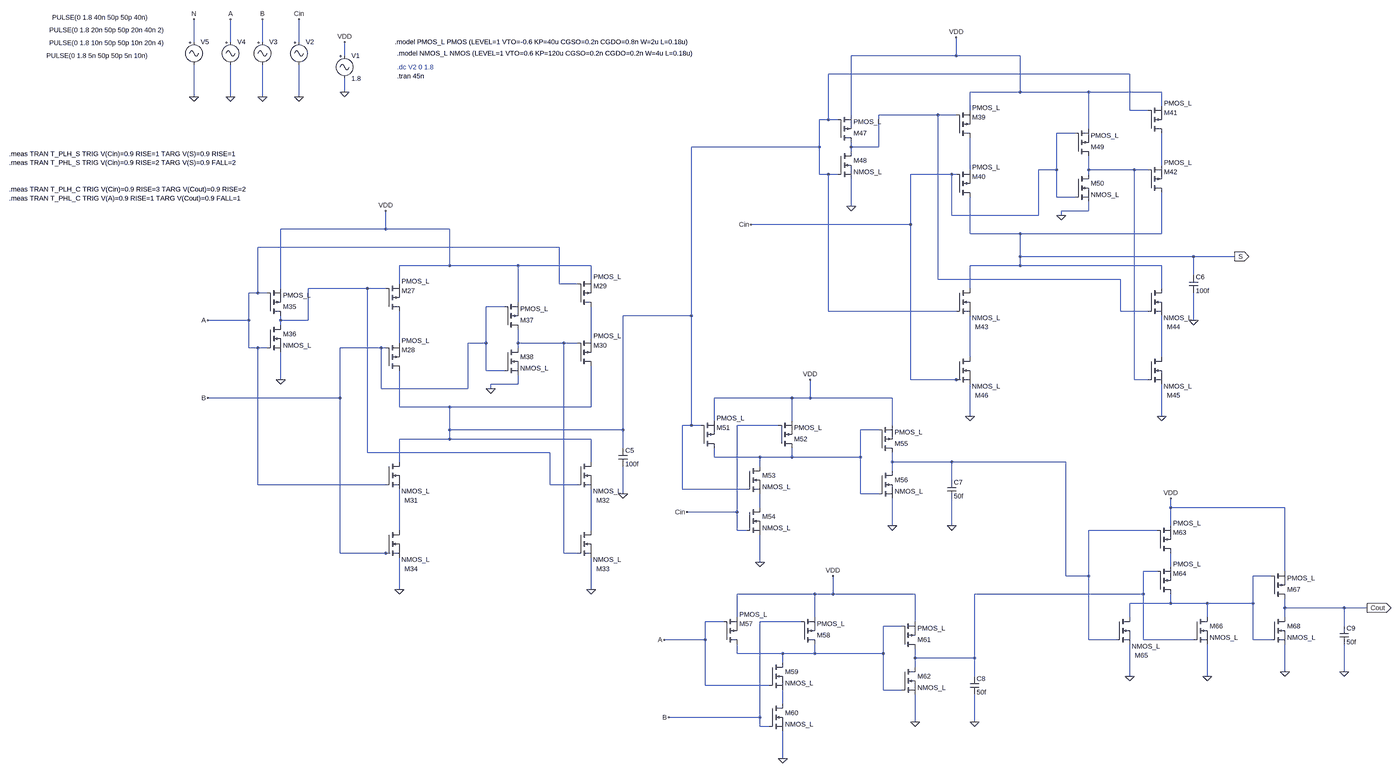
[diagram p0: schematic FullAdder.asc, whole sheet]
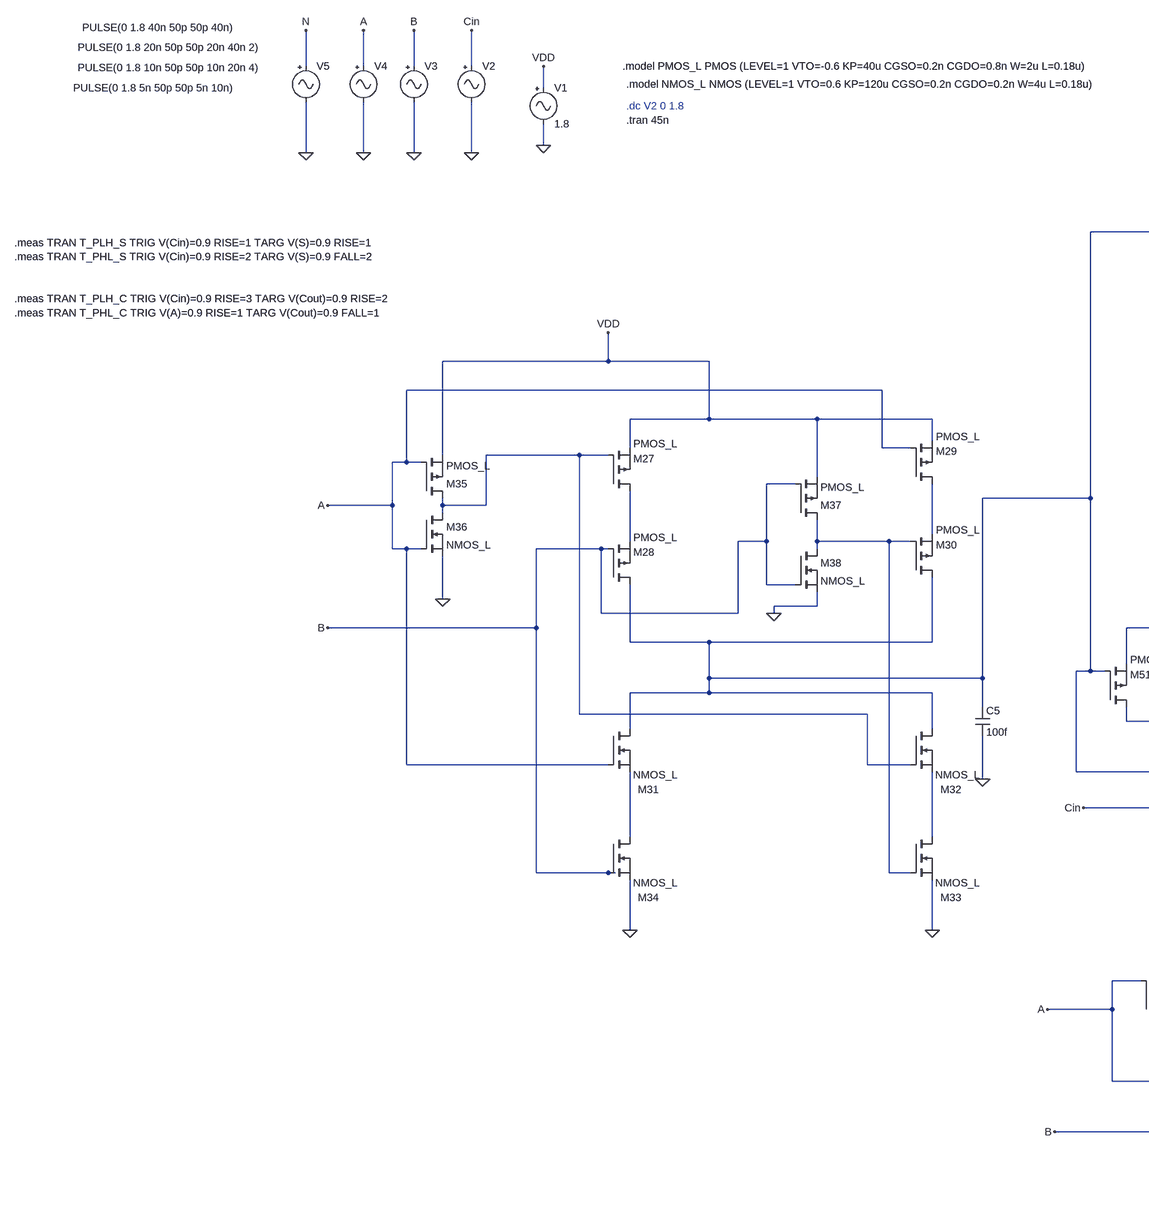
[diagram p1: schematic FullAdder.asc, part, row 1 of 1, column 1 of 2]
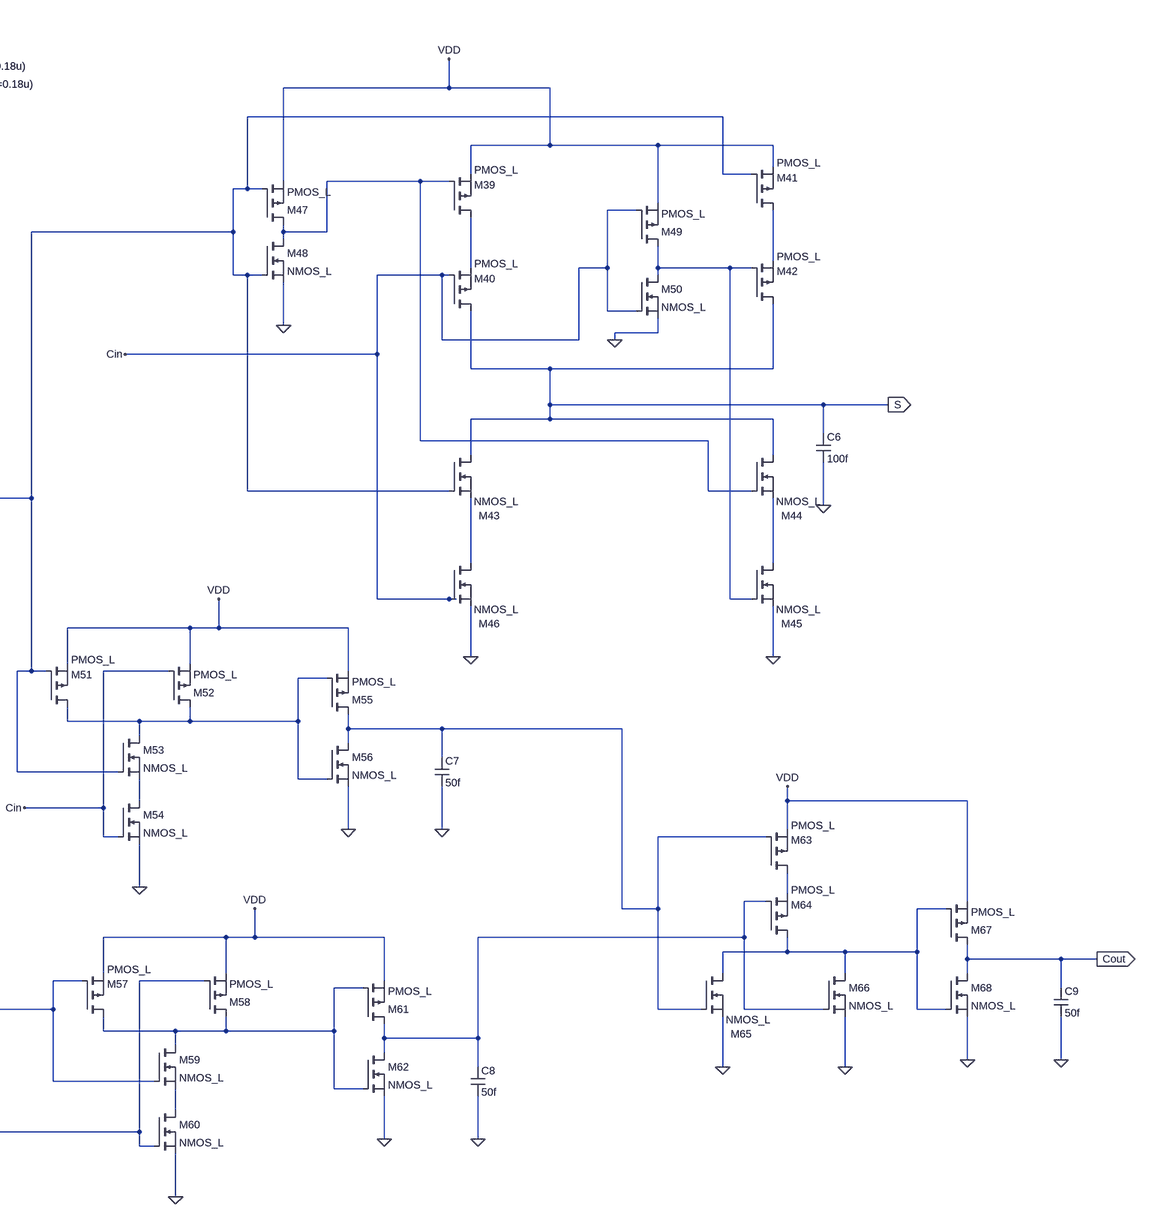
[diagram p2: schematic FullAdder.asc, part, row 1 of 1, column 2 of 2]
FullAdder.asc, the LTspice schematic file:
Version 4.1
SHEET 1 1064 4084
WIRE -4256 1552 -4256 1472
WIRE -4128 1552 -4128 1472
WIRE -4016 1552 -4016 1472
WIRE -3888 1552 -3888 1472
WIRE -3728 1600 -3728 1552
WIRE -1584 1600 -1584 1536
WIRE -1584 1600 -1952 1600
WIRE -1360 1600 -1584 1600
WIRE -976 1664 -2032 1664
WIRE -3728 1728 -3728 1680
WIRE -1360 1728 -1360 1600
WIRE -1360 1728 -1536 1728
WIRE -1120 1728 -1360 1728
WIRE -864 1728 -1120 1728
WIRE -4256 1744 -4256 1632
WIRE -4128 1744 -4128 1632
WIRE -4016 1744 -4016 1632
WIRE -3888 1744 -3888 1632
WIRE -864 1776 -864 1728
WIRE -1536 1792 -1536 1728
WIRE -976 1792 -976 1664
WIRE -912 1792 -976 1792
WIRE -1952 1808 -1952 1600
WIRE -1648 1808 -1856 1808
WIRE -1584 1808 -1648 1808
WIRE -2032 1824 -2032 1664
WIRE -2032 1824 -2064 1824
WIRE -2000 1824 -2032 1824
WIRE -1120 1856 -1120 1728
WIRE -1168 1872 -1232 1872
WIRE -2064 1920 -2064 1824
WIRE -2064 1920 -2512 1920
WIRE -1952 1920 -1952 1904
WIRE -1856 1920 -1856 1808
WIRE -1856 1920 -1952 1920
WIRE -1952 1936 -1952 1920
WIRE -864 1984 -864 1872
WIRE -1536 2000 -1536 1888
WIRE -1232 2000 -1232 1872
WIRE -1232 2000 -1296 2000
WIRE -1120 2000 -1120 1952
WIRE -960 2000 -1120 2000
WIRE -912 2000 -960 2000
WIRE -2064 2016 -2064 1920
WIRE -2032 2016 -2064 2016
WIRE -2000 2016 -2032 2016
WIRE -1600 2016 -1744 2016
WIRE -1584 2016 -1600 2016
WIRE -1120 2016 -1120 2000
WIRE -1232 2096 -1232 2000
WIRE -1168 2096 -1232 2096
WIRE -1952 2128 -1952 2032
WIRE -1120 2144 -1120 2112
WIRE -1120 2144 -1216 2144
WIRE -1600 2160 -1600 2016
WIRE -1296 2160 -1296 2000
WIRE -1296 2160 -1600 2160
WIRE -1216 2160 -1216 2144
WIRE -1744 2192 -1744 2016
WIRE -1744 2192 -2304 2192
WIRE -3584 2208 -3584 2144
WIRE -3584 2208 -3952 2208
WIRE -3360 2208 -3584 2208
WIRE -1536 2224 -1536 2096
WIRE -1360 2224 -1536 2224
WIRE -864 2224 -864 2080
WIRE -864 2224 -1360 2224
WIRE -2976 2272 -4032 2272
WIRE -1360 2304 -1360 2224
WIRE -752 2304 -1360 2304
WIRE -608 2304 -752 2304
WIRE -3360 2336 -3360 2208
WIRE -3360 2336 -3536 2336
WIRE -3120 2336 -3360 2336
WIRE -2864 2336 -3120 2336
WIRE -1360 2336 -1360 2304
WIRE -1360 2336 -1536 2336
WIRE -864 2336 -1360 2336
WIRE -752 2368 -752 2304
WIRE -2864 2384 -2864 2336
WIRE -1648 2384 -1648 1808
WIRE -1008 2384 -1648 2384
WIRE -3536 2400 -3536 2336
WIRE -2976 2400 -2976 2272
WIRE -2912 2400 -2976 2400
WIRE -3952 2416 -3952 2208
WIRE -3648 2416 -3856 2416
WIRE -3584 2416 -3648 2416
WIRE -1536 2416 -1536 2336
WIRE -864 2416 -864 2336
WIRE -4032 2432 -4032 2272
WIRE -4032 2432 -4064 2432
WIRE -4000 2432 -4032 2432
WIRE -3120 2464 -3120 2336
WIRE -3168 2480 -3232 2480
WIRE -2032 2496 -2032 2016
WIRE -1584 2496 -2032 2496
WIRE -1008 2496 -1008 2384
WIRE -912 2496 -1008 2496
WIRE -2512 2512 -2512 1920
WIRE -2512 2512 -2752 2512
WIRE -4064 2528 -4064 2432
WIRE -4064 2528 -4208 2528
WIRE -3952 2528 -3952 2512
WIRE -3856 2528 -3856 2416
WIRE -3856 2528 -3952 2528
WIRE -752 2528 -752 2432
WIRE -3952 2544 -3952 2528
WIRE -2864 2592 -2864 2480
WIRE -3536 2608 -3536 2496
WIRE -3232 2608 -3232 2480
WIRE -3232 2608 -3296 2608
WIRE -3120 2608 -3120 2560
WIRE -2960 2608 -3120 2608
WIRE -2912 2608 -2960 2608
WIRE -4064 2624 -4064 2528
WIRE -4032 2624 -4064 2624
WIRE -4000 2624 -4032 2624
WIRE -3600 2624 -3744 2624
WIRE -3584 2624 -3600 2624
WIRE -3120 2624 -3120 2608
WIRE -1536 2656 -1536 2512
WIRE -864 2656 -864 2512
WIRE -3232 2704 -3232 2608
WIRE -3168 2704 -3232 2704
WIRE -3952 2736 -3952 2640
WIRE -1744 2736 -1744 2192
WIRE -1584 2736 -1744 2736
WIRE -1568 2736 -1584 2736
WIRE -960 2736 -960 2000
WIRE -912 2736 -960 2736
WIRE -3120 2752 -3120 2720
WIRE -3120 2752 -3216 2752
WIRE -3600 2768 -3600 2624
WIRE -3296 2768 -3296 2608
WIRE -3296 2768 -3600 2768
WIRE -3216 2768 -3216 2752
WIRE -3744 2800 -3744 2624
WIRE -3744 2800 -4208 2800
WIRE -2160 2800 -2432 2800
WIRE -2096 2800 -2096 2736
WIRE -2096 2800 -2160 2800
WIRE -1808 2800 -2096 2800
WIRE -3536 2832 -3536 2704
WIRE -3360 2832 -3536 2832
WIRE -2864 2832 -2864 2688
WIRE -2864 2832 -3360 2832
WIRE -1536 2864 -1536 2752
WIRE -864 2864 -864 2752
WIRE -2432 2880 -2432 2800
WIRE -2160 2880 -2160 2800
WIRE -2512 2896 -2512 2512
WIRE -2512 2896 -2544 2896
WIRE -2480 2896 -2512 2896
WIRE -2208 2896 -2352 2896
WIRE -1808 2896 -1808 2800
WIRE -3360 2912 -3360 2832
WIRE -2752 2912 -2752 2512
WIRE -2752 2912 -3360 2912
WIRE -1856 2912 -1920 2912
WIRE -3360 2944 -3360 2912
WIRE -3360 2944 -3536 2944
WIRE -2864 2944 -3360 2944
WIRE -2752 2976 -2752 2912
WIRE -3648 2992 -3648 2416
WIRE -3008 2992 -3648 2992
WIRE -2432 3008 -2432 2976
WIRE -2272 3008 -2432 3008
WIRE -2160 3008 -2160 2976
WIRE -2160 3008 -2272 3008
WIRE -1920 3008 -1920 2912
WIRE -1920 3008 -2160 3008
WIRE -3536 3024 -3536 2944
WIRE -2864 3024 -2864 2944
WIRE -1808 3024 -1808 2992
WIRE -1600 3024 -1808 3024
WIRE -1200 3024 -1600 3024
WIRE -2272 3040 -2272 3008
WIRE -1808 3056 -1808 3024
WIRE -1600 3088 -1600 3024
WIRE -4032 3104 -4032 2624
WIRE -3584 3104 -4032 3104
WIRE -3008 3104 -3008 2992
WIRE -2912 3104 -3008 3104
WIRE -2544 3120 -2544 2896
WIRE -2320 3120 -2544 3120
WIRE -2752 3136 -2752 3040
WIRE -1920 3136 -1920 3008
WIRE -1856 3136 -1920 3136
WIRE -2272 3184 -2272 3136
WIRE -832 3184 -832 3152
WIRE -432 3184 -832 3184
WIRE -2352 3200 -2352 2896
WIRE -2352 3200 -2528 3200
WIRE -1808 3248 -1808 3152
WIRE -1600 3248 -1600 3152
WIRE -832 3248 -832 3184
WIRE -3536 3264 -3536 3120
WIRE -2864 3264 -2864 3120
WIRE -2352 3264 -2352 3200
WIRE -2320 3264 -2352 3264
WIRE -880 3264 -1120 3264
WIRE -3744 3344 -3744 2800
WIRE -3584 3344 -3744 3344
WIRE -3568 3344 -3584 3344
WIRE -2960 3344 -2960 2608
WIRE -2912 3344 -2960 3344
WIRE -2272 3376 -2272 3280
WIRE -832 3392 -832 3344
WIRE -880 3408 -928 3408
WIRE -432 3408 -432 3184
WIRE -1200 3424 -1200 3024
WIRE -1120 3424 -1120 3264
WIRE -1120 3424 -1200 3424
WIRE -480 3424 -544 3424
WIRE -3536 3472 -3536 3360
WIRE -2864 3472 -2864 3360
WIRE -2080 3488 -2352 3488
WIRE -2016 3488 -2016 3424
WIRE -2016 3488 -2080 3488
WIRE -1728 3488 -2016 3488
WIRE -928 3488 -928 3408
WIRE -928 3488 -1520 3488
WIRE -832 3520 -832 3488
WIRE -832 3520 -976 3520
WIRE -704 3520 -832 3520
WIRE -544 3520 -544 3424
WIRE -544 3520 -704 3520
WIRE -432 3536 -432 3504
WIRE -224 3536 -432 3536
WIRE -144 3536 -224 3536
WIRE -2352 3568 -2352 3488
WIRE -2080 3568 -2080 3488
WIRE -976 3568 -976 3520
WIRE -704 3568 -704 3520
WIRE -432 3568 -432 3536
WIRE -2400 3584 -2464 3584
WIRE -2128 3584 -2272 3584
WIRE -1728 3584 -1728 3488
WIRE -1776 3600 -1840 3600
WIRE -224 3600 -224 3536
WIRE -2464 3648 -2464 3584
WIRE -2464 3648 -2608 3648
WIRE -1120 3648 -1120 3424
WIRE -1024 3648 -1120 3648
WIRE -928 3648 -928 3488
WIRE -752 3648 -928 3648
WIRE -544 3648 -544 3520
WIRE -480 3648 -544 3648
WIRE -2352 3696 -2352 3664
WIRE -2192 3696 -2352 3696
WIRE -2080 3696 -2080 3664
WIRE -2080 3696 -2192 3696
WIRE -1840 3696 -1840 3600
WIRE -1840 3696 -2080 3696
WIRE -1728 3712 -1728 3680
WIRE -1520 3712 -1520 3488
WIRE -1520 3712 -1728 3712
WIRE -2192 3728 -2192 3696
WIRE -1728 3744 -1728 3712
WIRE -432 3760 -432 3664
WIRE -224 3760 -224 3664
WIRE -1520 3776 -1520 3712
WIRE -976 3776 -976 3664
WIRE -704 3776 -704 3664
WIRE -2464 3808 -2464 3648
WIRE -2240 3808 -2464 3808
WIRE -1840 3824 -1840 3696
WIRE -1776 3824 -1840 3824
WIRE -2192 3872 -2192 3824
WIRE -2272 3920 -2272 3584
WIRE -2272 3920 -2592 3920
WIRE -1728 3936 -1728 3840
WIRE -1520 3936 -1520 3840
WIRE -2272 3952 -2272 3920
WIRE -2240 3952 -2272 3952
WIRE -2192 4064 -2192 3968
FLAG -3728 1552 VDD
FLAG -3728 1728 0
FLAG -3888 1744 0
FLAG -3888 1472 Cin
FLAG -4016 1744 0
FLAG -4016 1472 B
FLAG -4128 1744 0
FLAG -4128 1472 A
FLAG -4256 1744 0
FLAG -4256 1472 N
FLAG -3584 2144 VDD
FLAG -2864 3472 0
FLAG -3536 3472 0
FLAG -2752 3136 0
FLAG -3216 2768 0
FLAG -4208 2528 A
FLAG -4208 2800 B
FLAG -3952 2736 0
FLAG -1584 1536 VDD
FLAG -864 2864 0
FLAG -1536 2864 0
FLAG -608 2304 S
IOPIN -608 2304 Out
FLAG -752 2528 0
FLAG -1216 2160 0
FLAG -1952 2128 0
FLAG -1808 3248 0
FLAG -1600 3248 0
FLAG -2096 2736 VDD
FLAG -2272 3376 0
FLAG -1728 3936 0
FLAG -1520 3936 0
FLAG -2016 3424 VDD
FLAG -2192 4064 0
FLAG -2304 2192 Cin
FLAG -2528 3200 Cin
FLAG -2608 3648 A
FLAG -2592 3920 B
FLAG -832 3152 VDD
FLAG -976 3776 0
FLAG -704 3776 0
FLAG -432 3760 0
FLAG -144 3536 Cout
IOPIN -144 3536 Out
FLAG -224 3760 0
SYMBOL Misc\\signal -3728 1584 R0
WINDOW 123 0 0 Left 0
WINDOW 39 0 0 Left 0
SYMATTR InstName V1
SYMATTR Value 1.8
SYMBOL Misc\\signal -3888 1536 R0
WINDOW 3 -885 64 Left 2
WINDOW 123 0 0 Left 0
WINDOW 39 0 0 Left 0
SYMATTR Value PULSE(0 1.8 5n 50p 50p 5n 10n)
SYMATTR InstName V2
SYMBOL Misc\\signal -4016 1536 R0
WINDOW 3 -747 19 Left 2
WINDOW 123 0 0 Left 0
WINDOW 39 0 0 Left 0
SYMATTR Value PULSE(0 1.8 10n 50p 50p 10n 20n 4)
SYMATTR InstName V3
SYMBOL Misc\\signal -4128 1536 R0
WINDOW 3 -635 -26 Left 2
WINDOW 123 0 0 Left 0
WINDOW 39 0 0 Left 0
SYMATTR Value PULSE(0 1.8 20n 50p 50p 20n 40n 2)
SYMATTR InstName V4
SYMBOL Misc\\signal -4256 1536 R0
WINDOW 3 -497 -70 Left 2
WINDOW 123 0 0 Left 0
WINDOW 39 0 0 Left 0
SYMATTR Value PULSE(0 1.8 40n 50p 50p 40n)
SYMATTR InstName V5
SYMBOL pmos -3584 2496 M180
WINDOW 0 56 72 Left 2
WINDOW 3 56 105 Left 2
SYMATTR InstName M27
SYMATTR Value PMOS_L
SYMBOL pmos -3584 2704 M180
WINDOW 0 56 72 Left 2
WINDOW 3 56 105 Left 2
SYMATTR InstName M28
SYMATTR Value PMOS_L
SYMBOL pmos -2912 2480 M180
WINDOW 0 56 72 Left 2
WINDOW 3 56 105 Left 2
SYMATTR InstName M29
SYMATTR Value PMOS_L
SYMBOL pmos -2912 2688 M180
WINDOW 0 56 72 Left 2
WINDOW 3 56 105 Left 2
SYMATTR InstName M30
SYMATTR Value PMOS_L
SYMBOL nmos -3584 3024 R0
WINDOW 0 66 135 Left 2
WINDOW 3 55 103 Left 2
SYMATTR InstName M31
SYMATTR Value NMOS_L
SYMBOL nmos -2912 3024 R0
WINDOW 0 66 135 Left 2
WINDOW 3 55 103 Left 2
SYMATTR InstName M32
SYMATTR Value NMOS_L
SYMBOL nmos -2912 3264 R0
WINDOW 0 66 135 Left 2
WINDOW 3 55 103 Left 2
SYMATTR InstName M33
SYMATTR Value NMOS_L
SYMBOL nmos -3584 3264 R0
WINDOW 0 66 135 Left 2
WINDOW 3 55 103 Left 2
SYMATTR InstName M34
SYMATTR Value NMOS_L
SYMBOL cap -2768 2976 R0
SYMATTR InstName C5
SYMATTR Value 100f
SYMBOL pmos -4000 2512 M180
SYMATTR InstName M35
SYMATTR Value PMOS_L
SYMBOL nmos -4000 2544 R0
SYMATTR InstName M36
SYMATTR Value NMOS_L
SYMBOL pmos -3168 2560 M180
SYMATTR InstName M37
SYMATTR Value PMOS_L
SYMBOL nmos -3168 2624 R0
SYMATTR InstName M38
SYMATTR Value NMOS_L
SYMBOL pmos -1584 1888 M180
WINDOW 0 56 72 Left 2
WINDOW 3 56 105 Left 2
SYMATTR InstName M39
SYMATTR Value PMOS_L
SYMBOL pmos -1584 2096 M180
WINDOW 0 56 72 Left 2
WINDOW 3 56 105 Left 2
SYMATTR InstName M40
SYMATTR Value PMOS_L
SYMBOL pmos -912 1872 M180
WINDOW 0 56 72 Left 2
WINDOW 3 56 105 Left 2
SYMATTR InstName M41
SYMATTR Value PMOS_L
SYMBOL pmos -912 2080 M180
WINDOW 0 56 72 Left 2
WINDOW 3 56 105 Left 2
SYMATTR InstName M42
SYMATTR Value PMOS_L
SYMBOL nmos -1584 2416 R0
WINDOW 0 66 135 Left 2
WINDOW 3 55 103 Left 2
SYMATTR InstName M43
SYMATTR Value NMOS_L
SYMBOL nmos -912 2416 R0
WINDOW 0 66 135 Left 2
WINDOW 3 55 103 Left 2
SYMATTR InstName M44
SYMATTR Value NMOS_L
SYMBOL nmos -912 2656 R0
WINDOW 0 66 135 Left 2
WINDOW 3 55 103 Left 2
SYMATTR InstName M45
SYMATTR Value NMOS_L
SYMBOL nmos -1584 2656 R0
WINDOW 0 66 135 Left 2
WINDOW 3 55 103 Left 2
SYMATTR InstName M46
SYMATTR Value NMOS_L
SYMBOL cap -768 2368 R0
SYMATTR InstName C6
SYMATTR Value 100f
SYMBOL pmos -2000 1904 M180
SYMATTR InstName M47
SYMATTR Value PMOS_L
SYMBOL nmos -2000 1936 R0
SYMATTR InstName M48
SYMATTR Value NMOS_L
SYMBOL pmos -1168 1952 M180
SYMATTR InstName M49
SYMATTR Value PMOS_L
SYMBOL nmos -1168 2016 R0
SYMATTR InstName M50
SYMATTR Value NMOS_L
SYMBOL pmos -2480 2976 M180
WINDOW 0 56 72 Left 2
WINDOW 3 56 105 Left 2
SYMATTR InstName M51
SYMATTR Value PMOS_L
SYMBOL pmos -2208 2976 M180
SYMATTR InstName M52
SYMATTR Value PMOS_L
SYMBOL nmos -2320 3040 R0
SYMATTR InstName M53
SYMATTR Value NMOS_L
SYMBOL nmos -2320 3184 R0
SYMATTR InstName M54
SYMATTR Value NMOS_L
SYMBOL pmos -1856 2992 M180
SYMATTR InstName M55
SYMATTR Value PMOS_L
SYMBOL nmos -1856 3056 R0
SYMATTR InstName M56
SYMATTR Value NMOS_L
SYMBOL cap -1616 3088 R0
SYMATTR InstName C7
SYMATTR Value 50f
SYMBOL pmos -2400 3664 M180
WINDOW 0 56 72 Left 2
WINDOW 3 56 105 Left 2
SYMATTR InstName M57
SYMATTR Value PMOS_L
SYMBOL pmos -2128 3664 M180
SYMATTR InstName M58
SYMATTR Value PMOS_L
SYMBOL nmos -2240 3728 R0
SYMATTR InstName M59
SYMATTR Value NMOS_L
SYMBOL nmos -2240 3872 R0
SYMATTR InstName M60
SYMATTR Value NMOS_L
SYMBOL pmos -1776 3680 M180
SYMATTR InstName M61
SYMATTR Value PMOS_L
SYMBOL nmos -1776 3744 R0
SYMATTR InstName M62
SYMATTR Value NMOS_L
SYMBOL cap -1536 3776 R0
SYMATTR InstName C8
SYMATTR Value 50f
SYMBOL pmos -880 3344 M180
WINDOW 0 56 72 Left 2
WINDOW 3 56 105 Left 2
SYMATTR InstName M63
SYMATTR Value PMOS_L
SYMBOL pmos -880 3488 M180
WINDOW 0 56 72 Left 2
WINDOW 3 56 105 Left 2
SYMATTR InstName M64
SYMATTR Value PMOS_L
SYMBOL nmos -1024 3568 R0
WINDOW 0 66 135 Left 2
WINDOW 3 55 103 Left 2
SYMATTR InstName M65
SYMATTR Value NMOS_L
SYMBOL nmos -752 3568 R0
SYMATTR InstName M66
SYMATTR Value NMOS_L
SYMBOL pmos -480 3504 M180
SYMATTR InstName M67
SYMATTR Value PMOS_L
SYMBOL nmos -480 3568 R0
SYMATTR InstName M68
SYMATTR Value NMOS_L
SYMBOL cap -240 3600 R0
SYMATTR InstName C9
SYMATTR Value 50f
TEXT -3544 1672 Left 2 !.tran 45n
TEXT -3552 1552 Left 2 !.model PMOS_L PMOS (LEVEL=1 VTO=-0.6 KP=40u CGSO=0.2n CGDO=0.8n W=2u L=0.18u)
TEXT -3544 1592 Left 2 !.model NMOS_L NMOS (LEVEL=1 VTO=0.6 KP=120u CGSO=0.2n CGDO=0.2n W=4u L=0.18u)
TEXT -3544 1640 Left 2 ;.dc V2 0 1.8
TEXT -4904 1944 Left 2 !.meas TRAN T_PLH_S TRIG V(Cin)=0.9 RISE=1 TARG V(S)=0.9 RISE=1\n.meas TRAN T_PHL_S TRIG V(Cin)=0.9 RISE=2 TARG V(S)=0.9 FALL=2  \n \n \n.meas TRAN T_PLH_C TRIG V(Cin)=0.9 RISE=3 TARG V(Cout)=0.9 RISE=2\n.meas TRAN T_PHL_C TRIG V(A)=0.9 RISE=1 TARG V(Cout)=0.9 FALL=1

The netlist it stands for:
* FullAdder.asc
V1 VDD 0 1.8
V2 Cin 0 PULSE(0 1.8 5n 50p 50p 5n 10n)
V3 B 0 PULSE(0 1.8 10n 50p 50p 10n 20n 4)
V4 A 0 PULSE(0 1.8 20n 50p 50p 20n 40n 2)
V5 N 0 PULSE(0 1.8 40n 50p 50p 40n)
M27 N008 N006 VDD VDD PMOS_L
M28 N001 B N008 N008 PMOS_L
M29 N007 A VDD VDD PMOS_L
M30 N001 N009 N007 N007 PMOS_L
M31 N001 A N015 N015 NMOS_L
M32 N001 N006 N016 N016 NMOS_L
M33 N016 N009 0 0 NMOS_L
M34 N015 B 0 0 NMOS_L
C5 N001 0 100f
M35 N006 A VDD VDD PMOS_L
M36 N006 A 0 0 NMOS_L
M37 N009 B VDD VDD PMOS_L
M38 N009 B 0 0 NMOS_L
M39 N004 N002 VDD VDD PMOS_L
M40 S Cin N004 N004 PMOS_L
M41 N003 N001 VDD VDD PMOS_L
M42 S N005 N003 N003 PMOS_L
M43 S N001 N010 N010 NMOS_L
M44 S N002 N011 N011 NMOS_L
M45 N011 N005 0 0 NMOS_L
M46 N010 Cin 0 0 NMOS_L
C6 S 0 100f
M47 N002 N001 VDD VDD PMOS_L
M48 N002 N001 0 0 NMOS_L
M49 N005 Cin VDD VDD PMOS_L
M50 N005 Cin 0 0 NMOS_L
M51 N012 N001 VDD VDD PMOS_L
M52 N012 Cin VDD VDD PMOS_L
M53 N012 N001 N014 N014 NMOS_L
M54 N014 Cin 0 0 NMOS_L
M55 N013 N012 VDD VDD PMOS_L
M56 N013 N012 0 0 NMOS_L
C7 N013 0 50f
M57 N020 A VDD VDD PMOS_L
M58 N020 B VDD VDD PMOS_L
M59 N020 A N021 N021 NMOS_L
M60 N021 B 0 0 NMOS_L
M61 N018 N020 VDD VDD PMOS_L
M62 N018 N020 0 0 NMOS_L
C8 N018 0 50f
M63 N017 N013 VDD VDD PMOS_L
M64 N019 N018 N017 N017 PMOS_L
M65 N019 N013 0 0 NMOS_L
M66 N019 N018 0 0 NMOS_L
M67 Cout N019 VDD VDD PMOS_L
M68 Cout N019 0 0 NMOS_L
C9 Cout 0 50f
.model NMOS NMOS
.model PMOS PMOS
.lib standard.mos
.tran 45n
.model PMOS_L PMOS (LEVEL=1 VTO=-0.6 KP=40u CGSO=0.2n CGDO=0.8n W=2u L=0.18u)
.model NMOS_L NMOS (LEVEL=1 VTO=0.6 KP=120u CGSO=0.2n CGDO=0.2n W=4u L=0.18u)
* .dc V2 0 1.8
.meas TRAN T_PLH_S TRIG V(Cin)=0.9 RISE=1 TARG V(S)=0.9 RISE=1
.meas TRAN T_PHL_S TRIG V(Cin)=0.9 RISE=2 TARG V(S)=0.9 FALL=2
.meas TRAN T_PLH_C TRIG V(Cin)=0.9 RISE=3 TARG V(Cout)=0.9 RISE=2
.meas TRAN T_PHL_C TRIG V(A)=0.9 RISE=1 TARG V(Cout)=0.9 FALL=1
.backanno
.end